# Altium schematic sheet UI_Ticketing_Slave.SchDoc
size A4; Organization: ETML-ES; Address1: Avenue Recordon 1; Address2: 1004 Lausanne; Address3: Switzerland
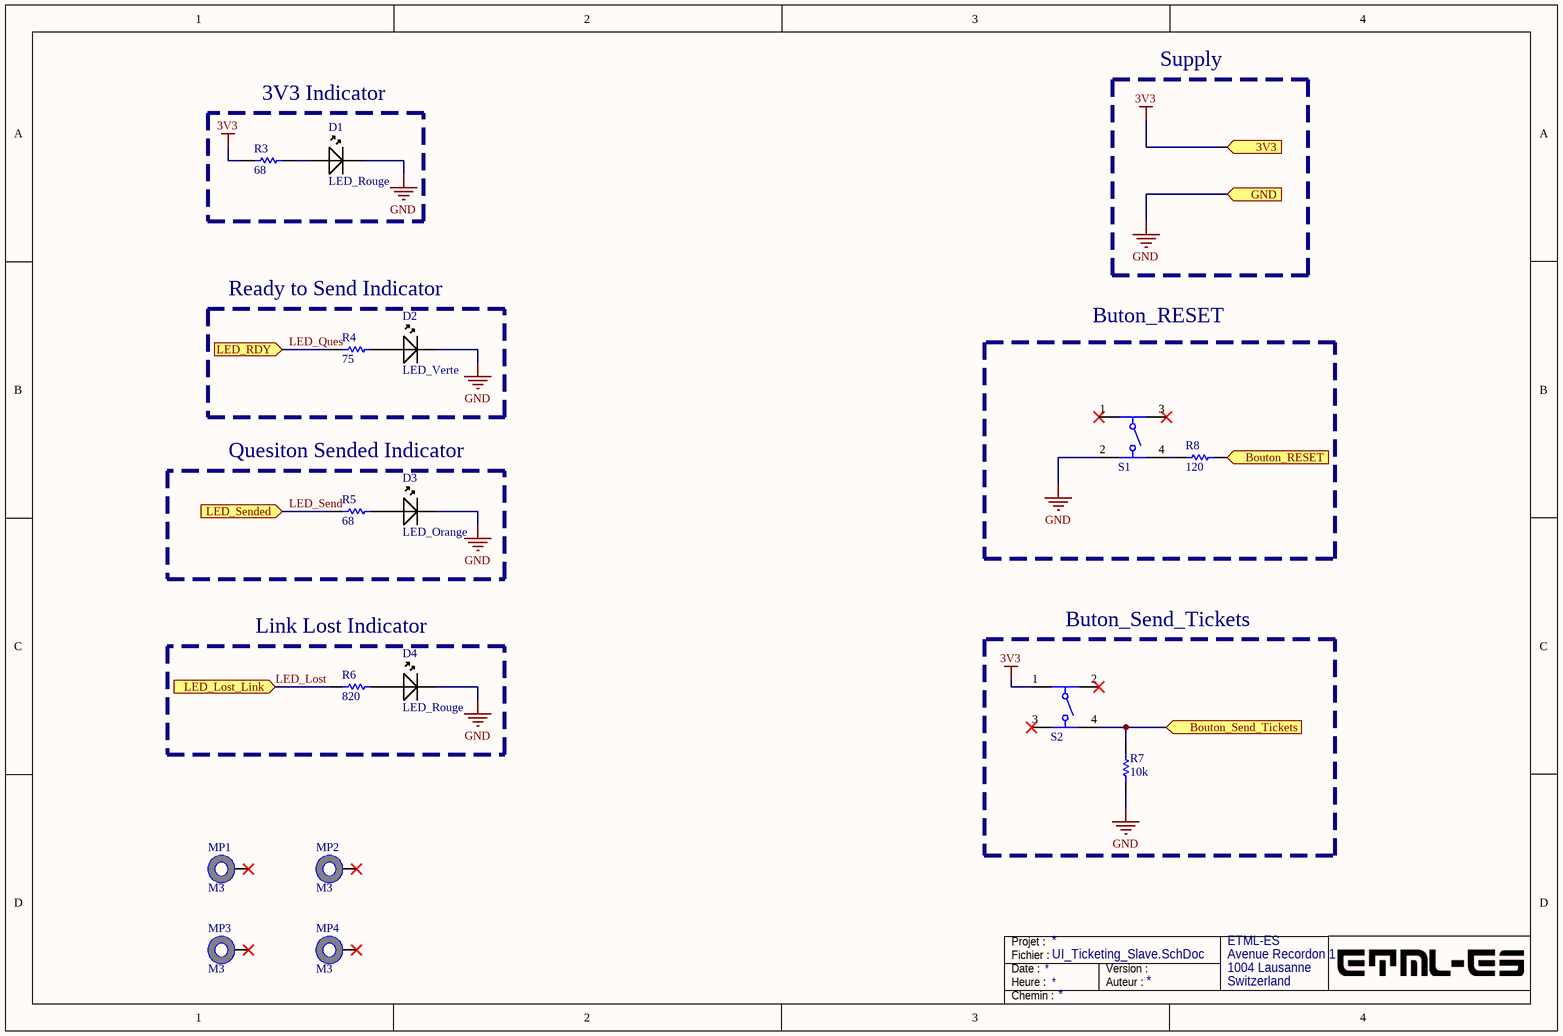
[diagram p0: UI_Ticketing_Slave.SchDoc]

## Parts
D1  LED_Rouge  [LED-2P-2.28-3MM]
D2  LED_Verte  [Type 5mm]
D3  LED_Orange  [Type 5mm]
D4  LED_Rouge  [Type 5mm]
MP1  M3  [9774010151]
MP2  M3  [9774010151]
MP3  M3  [9774010151]
MP4  M3  [9774010151]
R3  68  [RESC0805(2012)_L]
R4  75  [RESC0805(2012)_L]
R5  68  [RESC0805(2012)_L]
R6  820  [RESC0805(2012)_L]
R7  10k  [RESC0805(2012)_L]
R8  120  [RESC0805(2012)_L]
S1  430182050816  [430182050816]  (value not drawn)
S2  430466073726  [4304x60737x6_12x12x7.3]  (value not drawn)

## Blocks framed on the sheet
3V3 Indicator: D1 R3
Ready to Send Indicator: D2 R4
Buton_RESET: R8 S1
Quesiton Sended Indicator: D3 R5
Link Lost Indicator: D4 R6
Buton_Send_Tickets: R7 S2

## Ports
3V3, Bouton_RESET, Bouton_Send_Tickets, GND, LED_Lost_Link, LED_RDY, LED_Sended

## Nets
3V3: R3.2 S2.1 ; port 3V3
GND: D1.2(Cathode) D2.1(Cathode) D3.1(Cathode) D4.1(Cathode) R7.2 S1.2 ; port GND
Bouton_RESET: R8.2 ; port Bouton_RESET
Bouton_Send_Tickets: R7.1 S2.4 ; port Bouton_Send_Tickets
LED_Lost: R6.2 ; port LED_Lost_Link
LED_Ques: R4.2 ; port LED_RDY
LED_Send: R5.2 ; port LED_Sended
NetD1_1: D1.1(Anode) R3.1
NetD2_2: D2.2(Anode) R4.1
NetD3_2: D3.2(Anode) R5.1
NetD4_2: D4.2(Anode) R6.1
NetR8_1: R8.1 S1.4

Not connected (* = marked no-connect by the designer): MP1 1*; MP2 1*; MP3 1*; MP4 1*; S1 1* 3*; S2 2* 3*

## Notes on the sheet
- Supply
- Fichier :
- Date :
- Heure :
- Projet :
- Auteur :
- Version :
- Chemin :

## Library data of the parts
D1-D4 = LED: Supplier A: *; Supplier B: *; Supplier B Ref: *; Manufacturer URL: *; Manufacturer Ref: *; Package: *
  D1: Supplier A Ref: 754-1305-ND
  D2: Supplier A Ref: 754-1265-ND
  D3: Supplier A Ref: 754-1896-ND
  D4: Supplier A Ref: 754-1266-ND
MP1-MP4 = 9774010151: WA-SMSI SMT Steel Spacer, M2.5 Thread Internal, Length 1mm; InnerDiameter: 3.5mm; OuterDiameter: 5.1mm; PublishedDate: Dec. 2016; Publisher: Wurth Elektronik; ComponentLink1Description: Manufacturer; ComponentLink1URL: http://www.we-online.de; ComponentLink2Description: Datasheet; ComponentLink2URL: http://katalog.we-online.de/em/datasheet/9774010151.pdf; PartNumber: 9774010151; Length: 1mm; Thread: M2.5; Packaging: Bulk
R3 R4 R7 = CMP-1013-00122-1: 100K 0.125W 5% 0805 (2012 Metric)  SMD; Case-Metric: 2012; Case-EIA: 0805; Tolerance: 5 %; Technology: SMT; Power: 0.125 W
  R3: Value: 68
  R4: Value: 75
  R7: Value: 10k
R5 R6 = CMP-1013-00122-1: 100K 0.125W 5% 0805 (2012 Metric)  SMD; Case-Metric: 2012; Value: 680; Case-EIA: 0805; Tolerance: 5 %; Technology: SMT; Power: 0.125 W
R8 = CMP-1013-00122-1: 100K 0.125W 5% 0805 (2012 Metric)  SMD; Case-Metric: 2012; Value: 10k; Case-EIA: 0805; Tolerance: 5 %; Technology: SMT; Power: 0.125 W
S1 = 430182050816: 6x6mm SMD Tact Switch WS-TASV, height 5 mm, 160 gf; Rated Current: 50 mA; Operation Force: 160 gf; Rated Voltage: 12 VDC; ComponentLink1Description: Manufacturer; ComponentLink1URL: http://www.we-online.de; ComponentLink2Description: Datasheet; ComponentLink2URL: http://katalog.we-online.de/em/datasheet/4301x2xxx8x6.pdf; Part Number: 430182050816; Published Date: Nov. 2017; Publisher: Wurth Elektronik; Life Cycle: 1000000; Operating Temperature: -40 to +85 degC; Size: 6x6x5 mm
S2 = 430466073726: WS-TATV 12x12mm washable Tact Switch, THT version; Operation Force: 260g; ComponentLink1Description: Manufacturer; ComponentLink1URL: http://www.we-online.de; ComponentLink2Description: Datasheet; ComponentLink2URL: http://katalog.we-online.de/em/datasheet/4304x60737x6.pdf; Part Number: 430466073726; Published Date: June 2017; Publisher: Wurth Elektronik; Size: 12x12x7.3 mm; Life Cycle: 300000 cycles